# EAGLE design Digital_Level_Mainboard_T01_v2 (EAGLE 7.4.0)
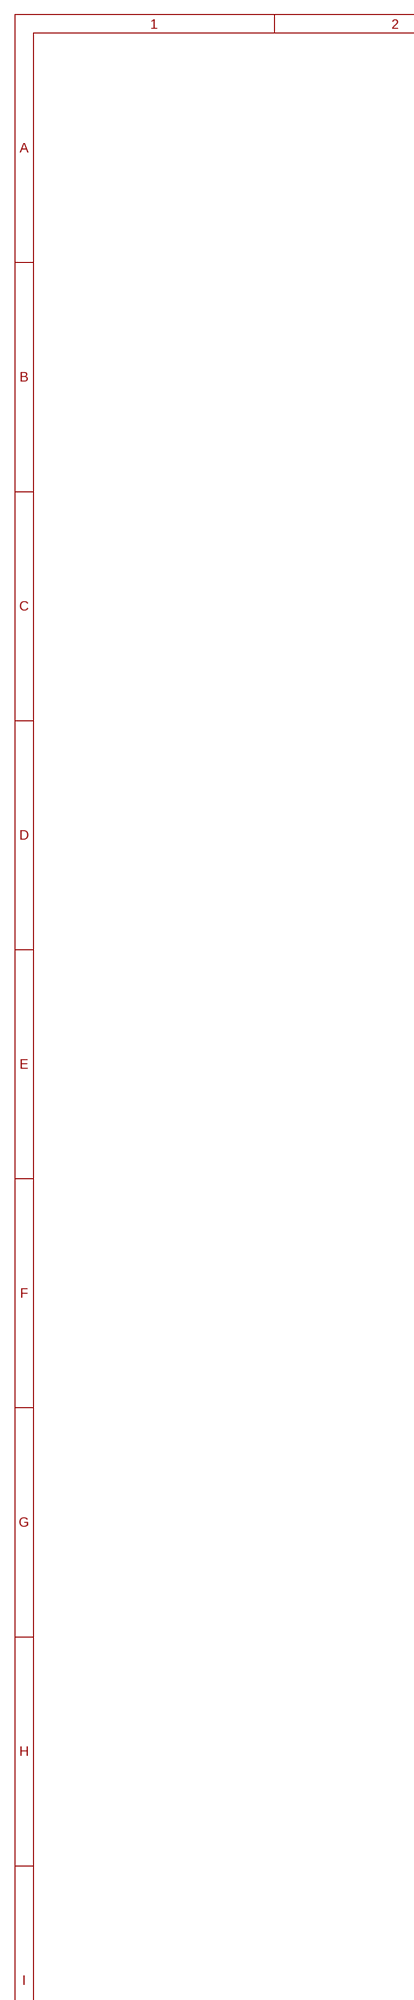
[diagram p0: schematic, sheet 1, part 1 of 2]
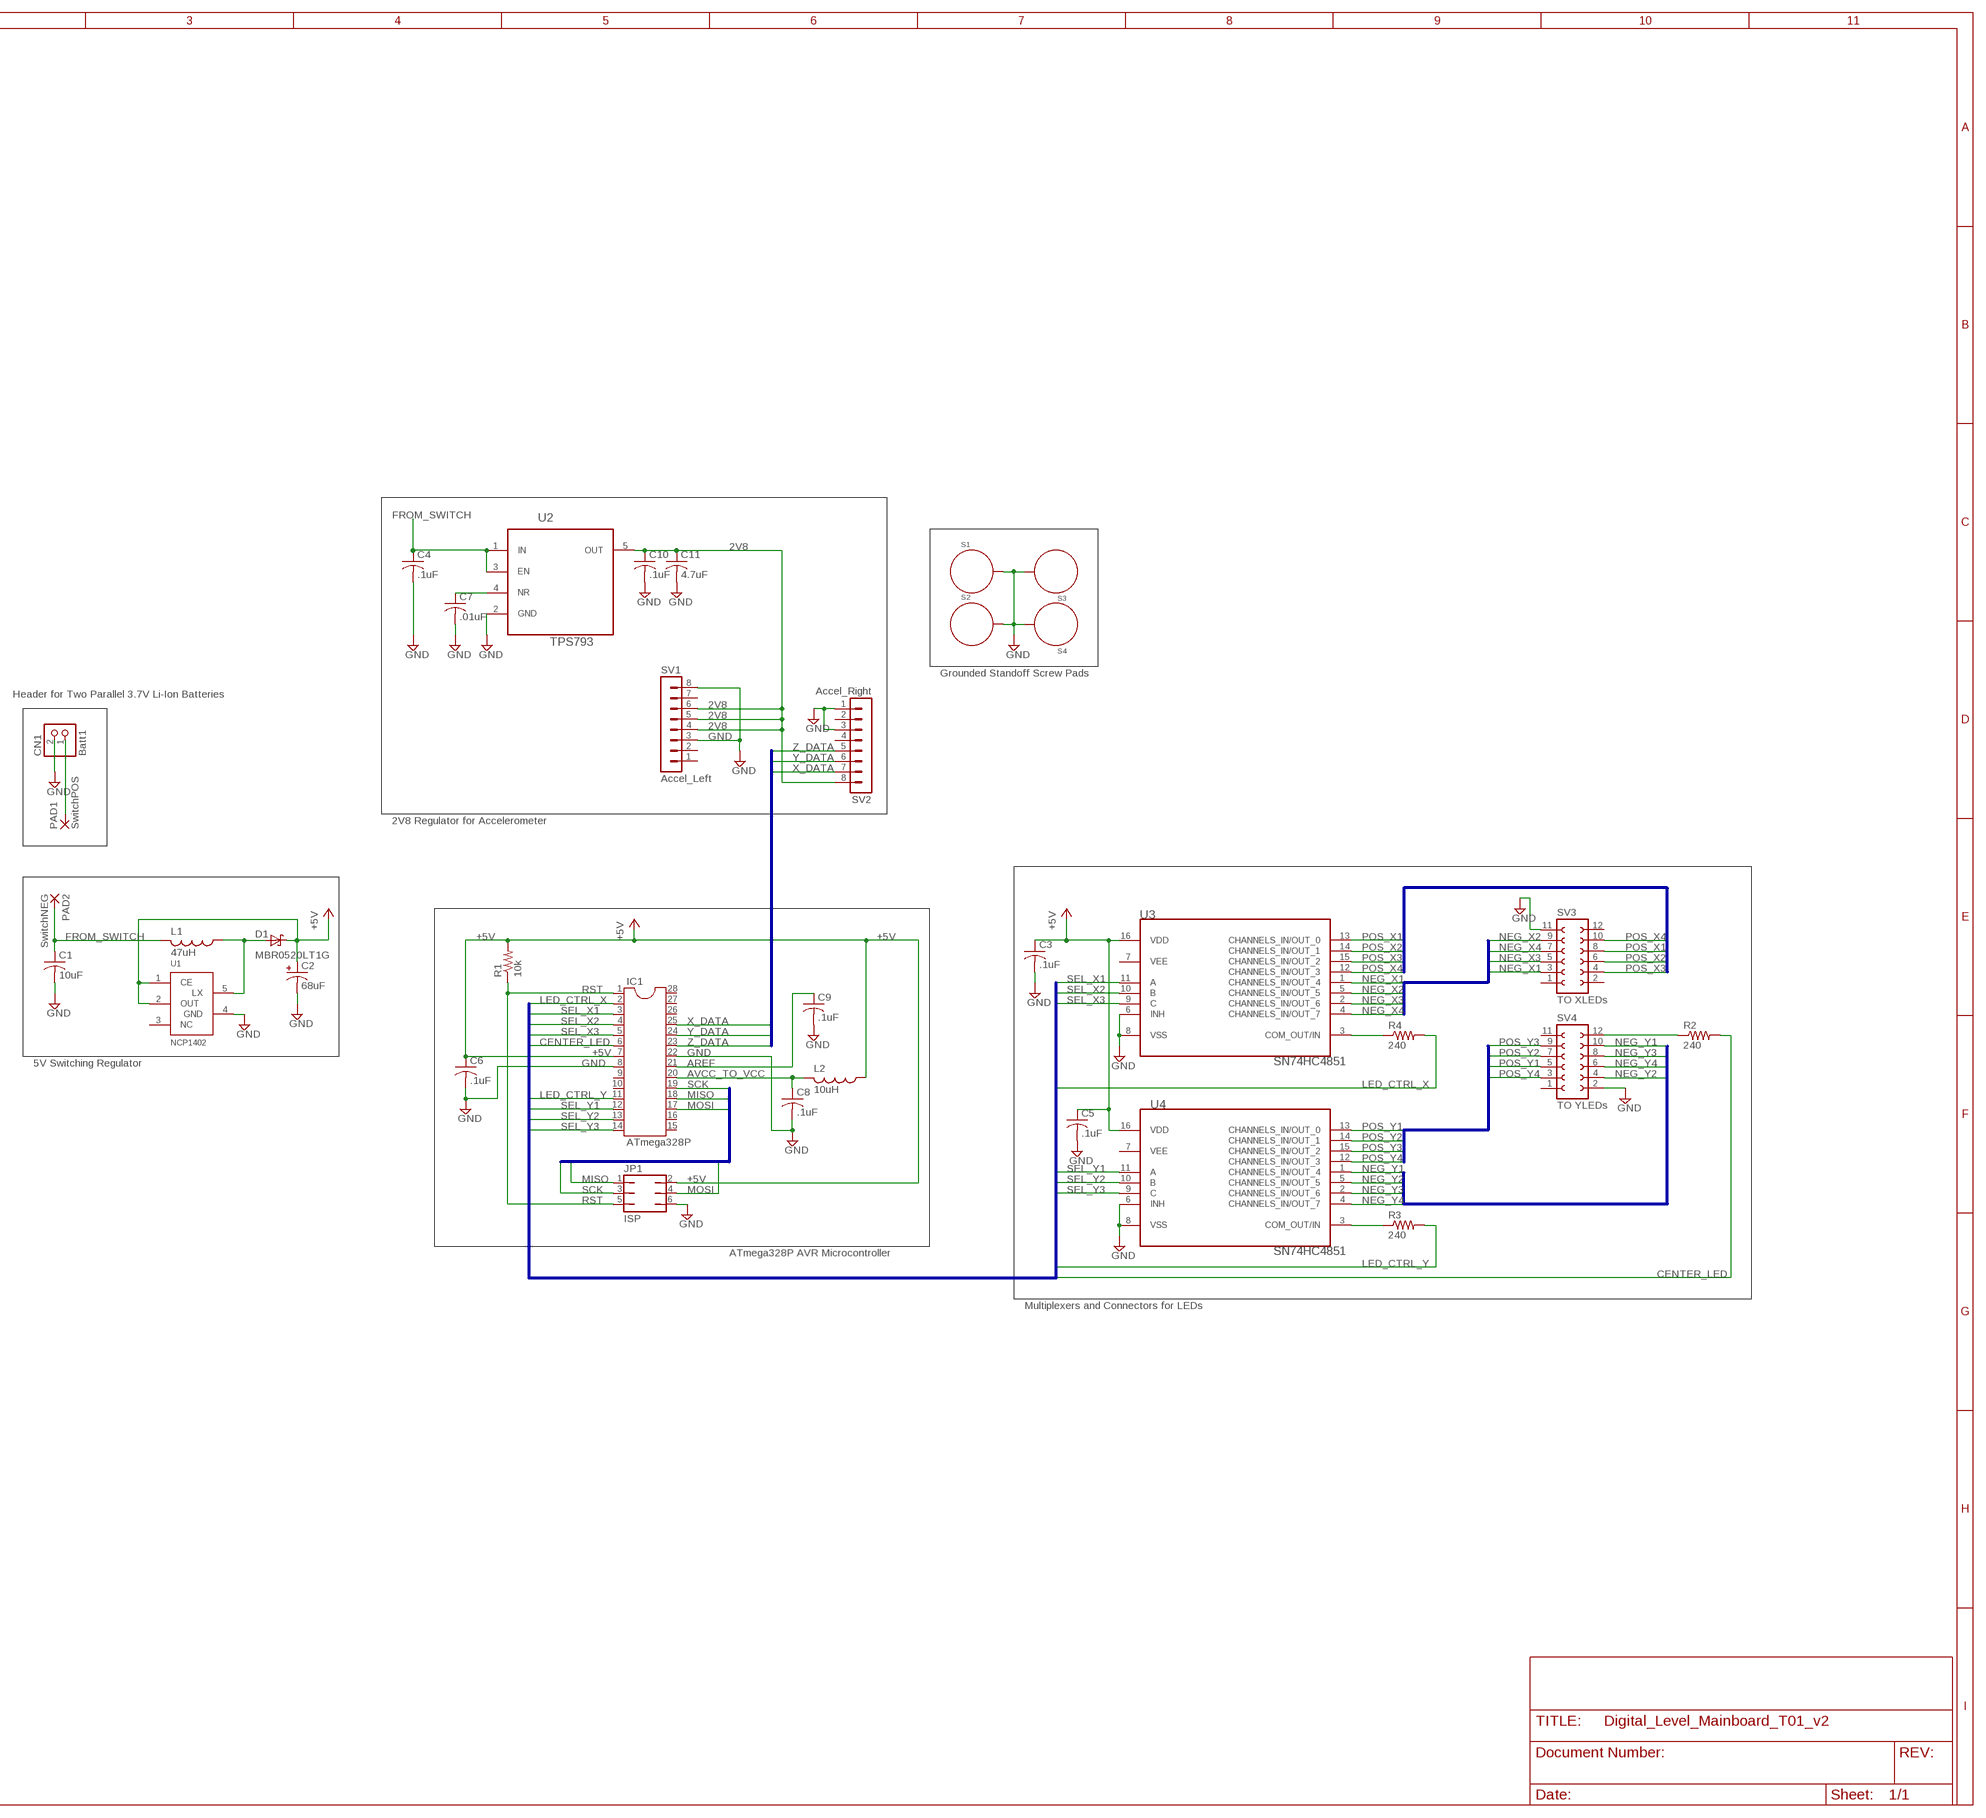
[diagram p1: schematic, sheet 1, part 2 of 2]

## Parts
C1  10uF  C-USC1206K  [C1206K]
C2  68uF  TANT_CAP  [2312_CAP]
C3  .1uF  C-USC1206K  [C1206K]
C4  .1uF  C-USC1206K  [C1206K]
C5  .1uF  C-USC1206K  [C1206K]
C6  .1uF  C-USC1206K  [C1206K]
C7  .01uF  C-USC1206K  [C1206K]
C8  .1uF  C-USC1206K  [C1206K]
C9  .1uF  C-USC1206K  [C1206K]
C10  .1uF  C-USC1206K  [C1206K]
C11  4.7uF  C-USC1206K  [C1206K]
CN1  Batt1  JST_2PIN-SMT  [JST-PH-2-SMT]
D1  MBR0520LT1G  ONSEMI_SCHOTTKY  [MBR0520]
IC1  ATmega328P  DIL28-3  [DIL28-3]
JP1  ISP  JP3Q  [JP3Q]
L1  47uH  BOURNS_INDUCTOR  [BOURNS_INDUCTOR]
L2  10uH  L-USL1812  [L1812]
PAD1  SwitchPOS  2,54/1,1  [2,54/1,1]
PAD2  SwitchNEG  2,54/1,1  [2,54/1,1]
R1  10k  R-US_R0805  [R0805]
R2  240  R-US_R1206  [R1206]
R3  240  R-US_R1206  [R1206]
R4  240  R-US_R1206  [R1206]
S1  STANDOFF_ELECTRICAL  [STANDOFF-ELECTRICAL]
S2  STANDOFF_ELECTRICAL  [STANDOFF-ELECTRICAL]
S3  STANDOFF_ELECTRICAL  [STANDOFF-ELECTRICAL]
S4  STANDOFF_ELECTRICAL  [STANDOFF-ELECTRICAL]
SV1  Accel_Left  MA08-1  [MA08-1]
SV2  Accel_Right  MA08-1  [MA08-1]
SV3  TO XLEDs  FE06-2  [FE06-2]
SV4  TO YLEDs  FE06-2  [FE06-2]
U1  NCP1402  [WSON-8]
U2  TPS793  TPS79328DBVR  [SOT95P280X145-5N]
U3  SN74HC4851  CD4051BE  [DIP254P762X508-16]
U4  SN74HC4851  CD4051BE  [DIP254P762X508-16]

## Nets
2V8: C10.1 C11.1 SV1.4 SV1.5 SV1.6 SV2.8 U2.5(OUT)
5V_REG1_LX: D1.P$2(A) L1.P$1 U1.5(LX)
+5V: C2.P C3.1 C5.1 C6.1 D1.P$1(K) IC1.7 JP1.2 L2.1 R1.2 U1.1(CE) U1.2(OUT) U3.16(VDD) U4.16(VDD)
AREF: C9.1 IC1.21
AVCC_TO_VCC: C8.1 IC1.20 L2.2
CENTER_LED: IC1.6 R2.2
CENTER_LED_CONN: R2.1 SV4.12
CTRL_X_TO_MUX: R4.1 U3.3(COM_OUT/IN)
CTRL_Y_TO_MUX: R3.1 U4.3(COM_OUT/IN)
FROM_SWITCH: C1.1 C4.1 L1.P$2 PAD2.1(P) U2.1(IN) U2.3(EN)
GND: C1.2 C2.N C3.2 C4.2 C5.2 C6.2 C7.2 C8.2 C9.2 C10.2 C11.2 CN1.2 IC1.8 IC1.22 JP1.6 S1.P1 S2.P1 S3.P1 S4.P1 SV1.3 SV1.8 SV2.1 SV2.3 SV3.11 SV4.2 U1.4(GND) U2.2(GND) U3.6(INH) U3.8(VSS) U4.6(INH) U4.8(VSS)
LED_CTRL_X: IC1.2 R4.2
LED_CTRL_Y: IC1.11 R3.2
LIN-REG_NR-PIN: C7.1 U2.4(NR)
MISO: IC1.18 JP1.1
MOSI: IC1.17 JP1.4
NEG_X1: SV3.3 U3.1(CHANNELS_IN/OUT_4)
NEG_X2: SV3.9 U3.5(CHANNELS_IN/OUT_5)
NEG_X3: SV3.5 U3.2(CHANNELS_IN/OUT_6)
NEG_X4: SV3.7 U3.4(CHANNELS_IN/OUT_7)
NEG_Y1: SV4.10 U4.1(CHANNELS_IN/OUT_4)
NEG_Y2: SV4.4 U4.5(CHANNELS_IN/OUT_5)
NEG_Y3: SV4.8 U4.2(CHANNELS_IN/OUT_6)
NEG_Y4: SV4.6 U4.4(CHANNELS_IN/OUT_7)
POS_BATT: CN1.1 PAD1.1(P)
POS_X1: SV3.8 U3.13(CHANNELS_IN/OUT_0)
POS_X2: SV3.6 U3.14(CHANNELS_IN/OUT_1)
POS_X3: SV3.4 U3.15(CHANNELS_IN/OUT_2)
POS_X4: SV3.10 U3.12(CHANNELS_IN/OUT_3)
POS_Y1: SV4.5 U4.13(CHANNELS_IN/OUT_0)
POS_Y2: SV4.7 U4.14(CHANNELS_IN/OUT_1)
POS_Y3: SV4.9 U4.15(CHANNELS_IN/OUT_2)
POS_Y4: SV4.3 U4.12(CHANNELS_IN/OUT_3)
RST: IC1.1 JP1.5 R1.1
SCK: IC1.19 JP1.3
SEL_X1: IC1.3 U3.11(A)
SEL_X2: IC1.4 U3.10(B)
SEL_X3: IC1.5 U3.9(C)
SEL_Y1: IC1.12 U4.11(A)
SEL_Y2: IC1.13 U4.10(B)
SEL_Y3: IC1.14 U4.9(C)
X_DATA: IC1.25 SV2.7
Y_DATA: IC1.24 SV2.6
Z_DATA: IC1.23 SV2.5
Unconnected: IC1.9 IC1.10 IC1.15 IC1.16 IC1.26 IC1.27 IC1.28 SV1.1 SV1.2 SV1.7 SV2.2 SV2.4 SV3.1 SV3.2 SV3.12 SV4.1 SV4.11 U1.3(NC) U3.7(VEE) U4.7(VEE)

## Buses
NEG_Y4,NEG_Y3,NEG_Y2,NEG_Y1
POS_X1,POS_X2,POS_X3,POS_X4
NEG_X4,NEG_X3,NEG_X2,NEG_X1
POS_Y1,POS_Y2,POS_Y3,POS_Y4
X_DATA,Y_DATA,Z_DATA
MISO,MOSI,SCK
LED_CTRL_X,SEL_X1,SEL_X2,SEL_X3,CENTER_LED,LED_CTRL_Y,SEL_Y1,SEL_Y2,SEL_Y3

## Notes on the sheet
- Grounded Standoff Screw Pads
- Header for Two Parallel 3.7V Li-Ion Batteries
- 2V8 Regulator for Accelerometer
- 5V Switching Regulator
- ATmega328P AVR Microcontroller
- Multiplexers and Connectors for LEDs

## Library data of the parts
C1 C3-C11 = rcl:C-US: CAPACITOR, American symbol
C2 = cal_zabel:TANT_CAP
CN1 = adafruit:JST_2PIN: JST 2-Pin Connectors of various flavors SMT-RA (S2B-PH-SM4) 4UConnector #17311 SMT (B2B-PH-SM4) THM-RA (S2B-PH) THM (B2B-PH)
D1 = cal_zabel:ONSEMI_SCHOTTKY
IC1 = ic-package:DIL28: Dual In Line
JP1 = jumper:JP3Q: JUMPER
L1 = cal_zabel:BOURNS_INDUCTOR
L2 = rcl:L-US: INDUCTOR, American symbol
PAD1 PAD2 = wirepad:2,54/1,1: THROUGH-HOLE PAD
R1-R4 = rcl:R-US_: RESISTOR, American symbol
S1-S4 = SparkFun-Electromechanical:STANDOFF_ELECTRICAL: A standoff intended to be an electrically connected point. Pad size and stop size allow for a #4 Phillips pan screw head to make a solid connection to the board.
SV1 SV2 = con-lstb:MA08-1: PIN HEADER; OC_FARNELL: unknown; OC_NEWARK: unknown
SV3 SV4 = con-lsta:FE06-2: FEMALE HEADER; OC_FARNELL: unknown; OC_NEWARK: unknown
U1 = cal_zabel:NCP1402
U2 = Texas Instruments_By_element14_Batch_1:TPS79328DBVR: ULTRALOW-NOISE, HIGH PSRR, FAST RF 200mA LOW-DROPOUT LINEAR REGULATORS IN NanoStar? WAFER CHIP SCALE AND SOT23; MPN: TPS79328DBVR; OC_FARNELL: -; OC_NEWARK: 77C1361; PACKAGE: SOT-23-5; SUPPLIER: Texas Instruments
U3 U4 = Texas Instruments_By_element14_Batch_1:CD4051BE: The CD4051B is a single 8-Channel multiplexer having three binary control inputs.; MPN: CD4051BE; OC_FARNELL: 1106109; OC_NEWARK: 60K5119; PACKAGE: PDIP-16; SUPPLIER: Texas Instruments

## Board
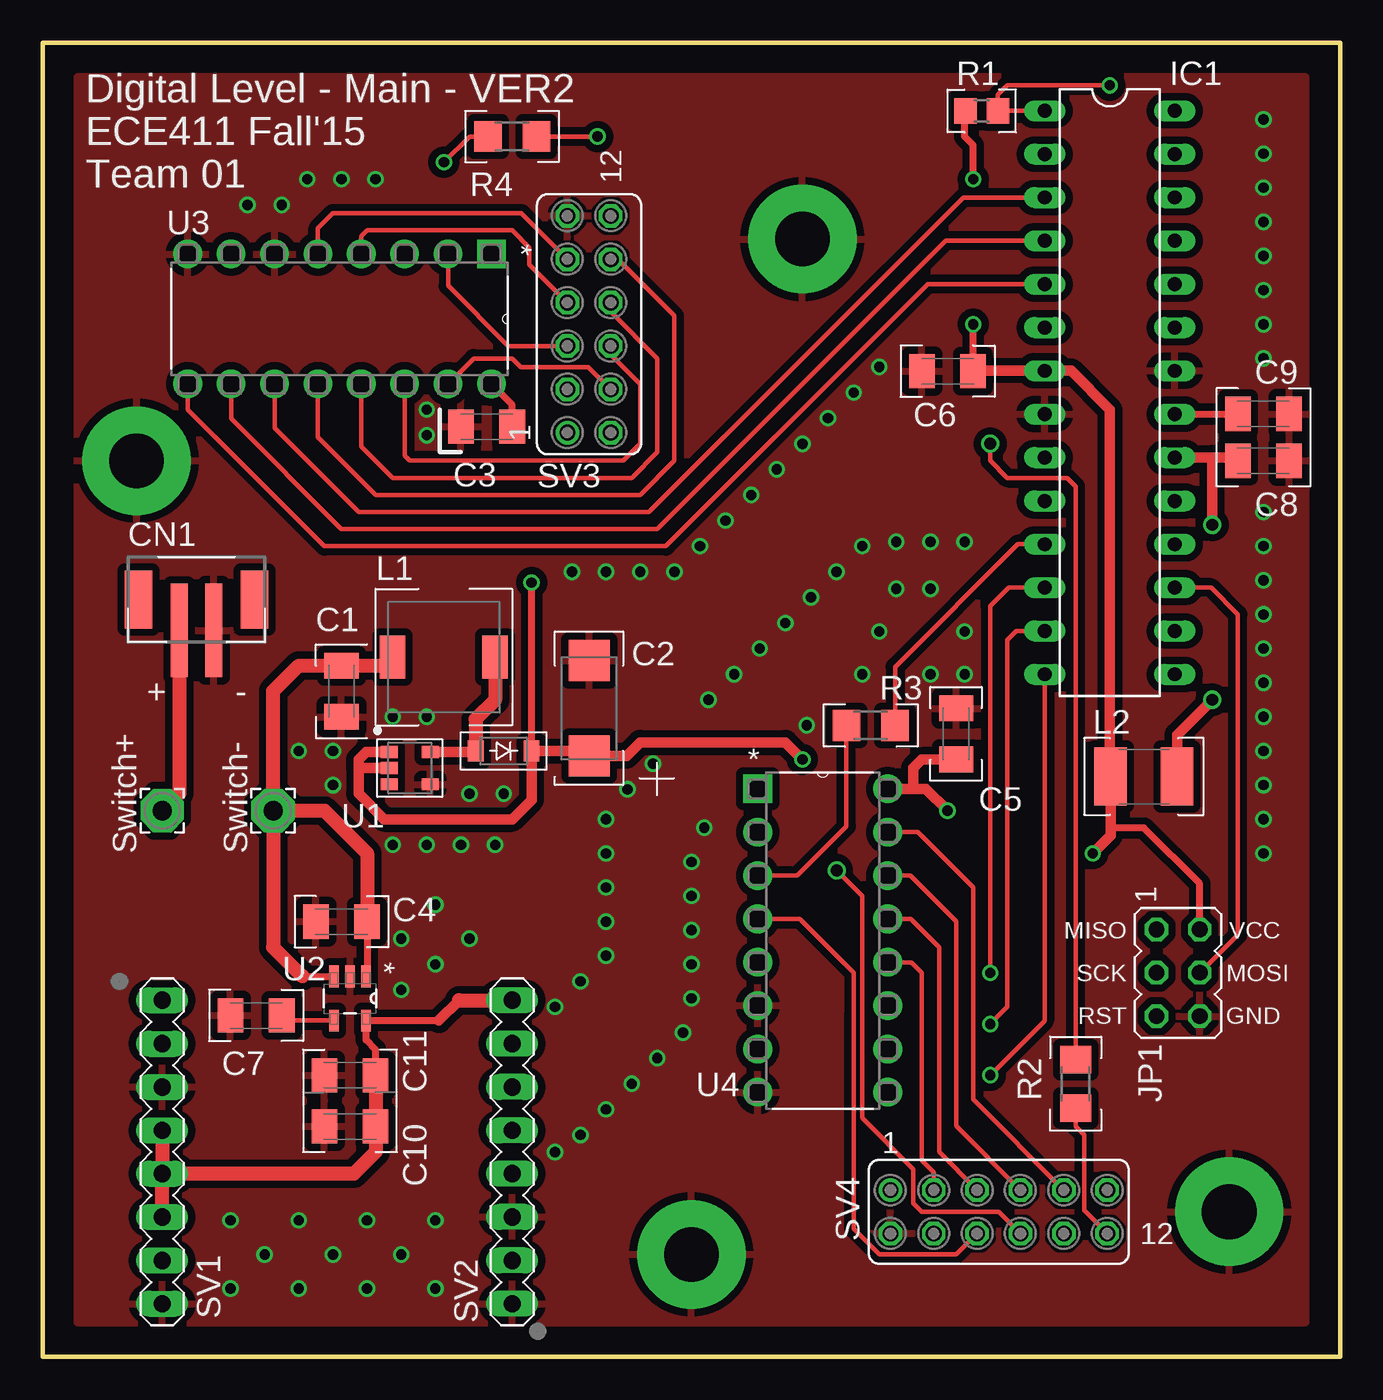
[diagram p2: board, top side]
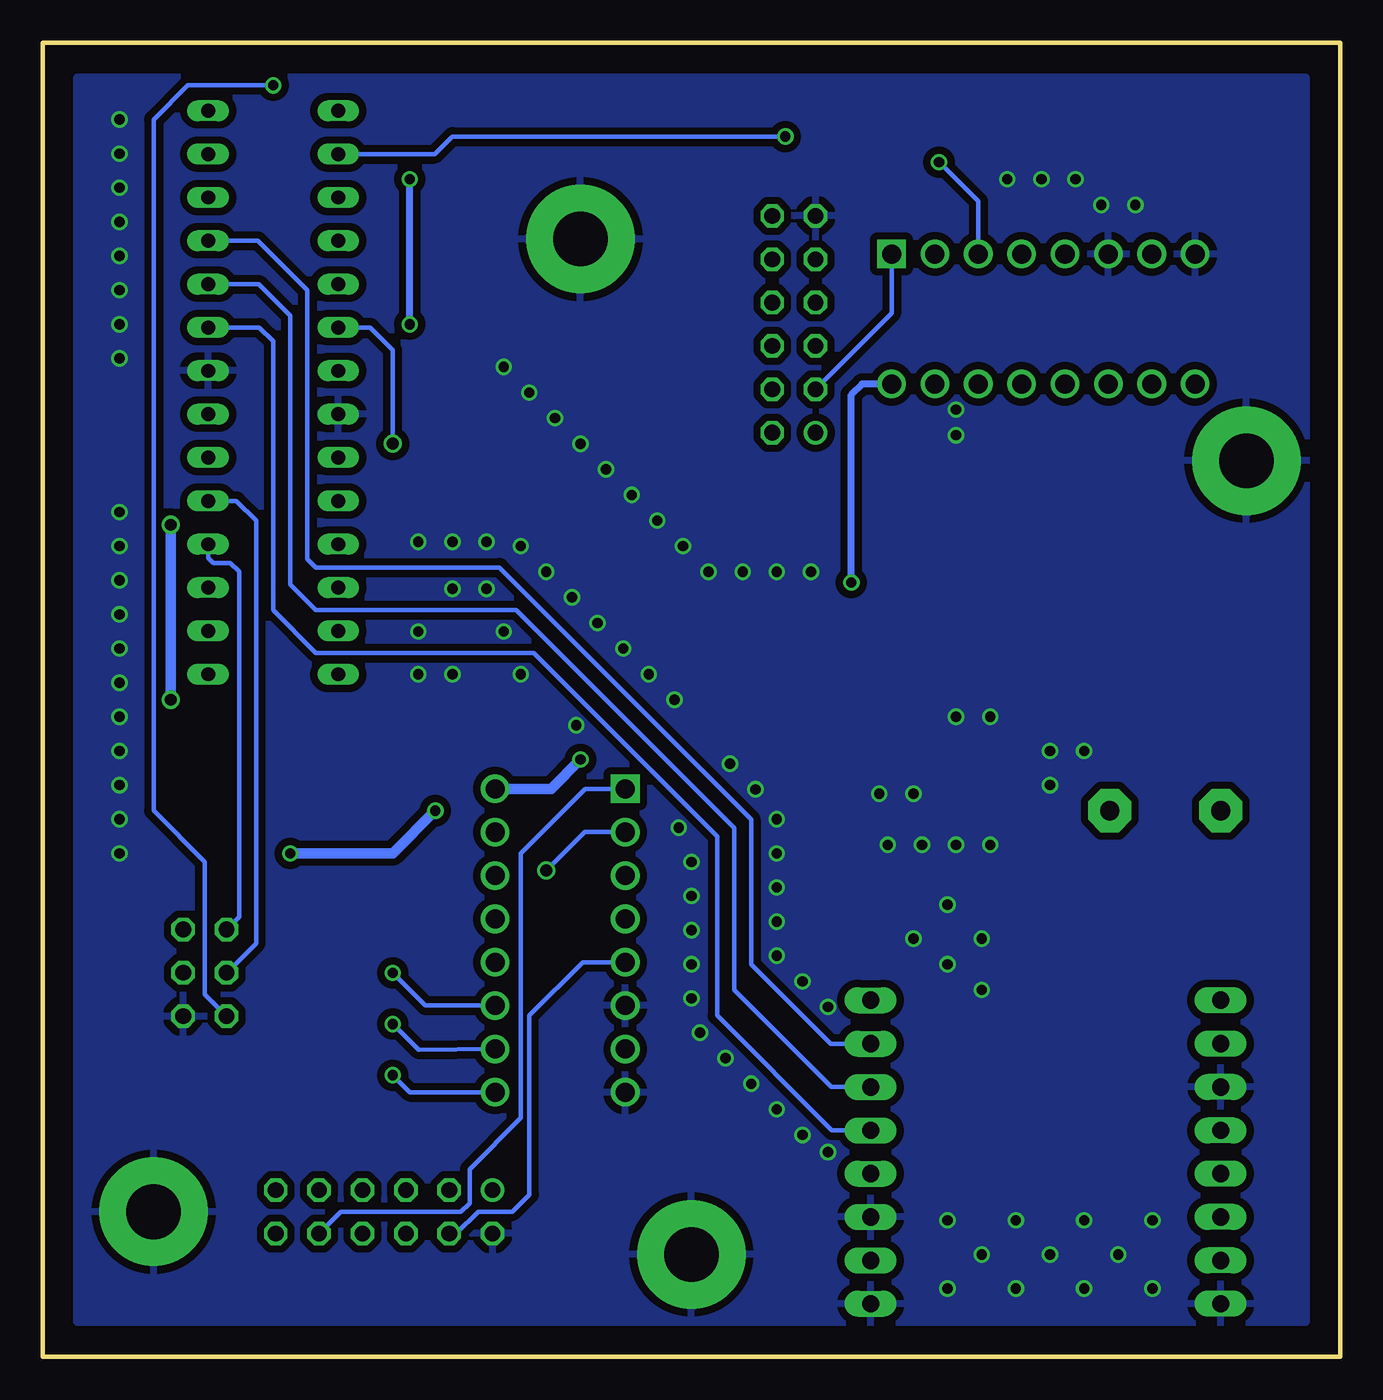
[diagram p3: board, bottom side, seen from below]

Size 76 x 77 mm. Coordinates in mm from the lower left corner, seen from the top.
Outline: 0,0 76,0 76,77 0,77 0,0
Copper layers (1*16): Top 0.0356mm / dielectric 1.5011mm / Bottom 0.0356mm
Design rules "LaenPCBOrder *": minimum track width 6mil, minimum drill 13mil, track to track 8mil, track to pad 8mil, pad to pad 8mil, via to via 8mil, smd to smd 8mil, copper to edge 15mil, drill to drill 6mil, minimum pad ring 7mil, minimum via ring 7mil, stop-mask expansion 3mil, vias tented up to drill 30mil, thermal gap 18mil

### Footprints (pad centres in the part's own frame; a part is rotated, then mirrored left to right if it is on the bottom)
C1206K = smd 1.5 x 2: 1 -1.5,0; 2 1.5,0
2312_CAP = smd 2.4 x 2.4: N -2.8,0; P 2.8,0
JST-PH-2-SMT = smd 1 x 5.5: 1 -1,-1.8; 2 1,-1.8 | smd 1.6 x 3.4: NC1 -3.4,0; NC2 3.4,0
MBR0520 = smd 0.91 x 1.22: P$1 -1.635,0; P$2 1.635,0
DIL28-3 = drill 0.813 long: 1 -16.51,-3.81; 2 -13.97,-3.81; 3 -11.43,-3.81; 4 -8.89,-3.81; 5 -6.35,-3.81; 6 -3.81,-3.81; 7 -1.27,-3.81; 8 1.27,-3.81; 9 3.81,-3.81; 10 6.35,-3.81; 11 8.89,-3.81; 12 11.43,-3.81; 13 13.97,-3.81; 14 16.51,-3.81; 15 16.51,3.81; 16 13.97,3.81; 17 11.43,3.81; 18 8.89,3.81; 19 6.35,3.81; 20 3.81,3.81; 21 1.27,3.81; 22 -1.27,3.81; 23 -3.81,3.81; 24 -6.35,3.81; 25 -8.89,3.81; 26 -11.43,3.81; 27 -13.97,3.81; 28 -16.51,3.81
JP3Q = drill 0.914 octagon: 1 -2.54,-1.27; 2 -2.54,1.27; 3 0,-1.27; 4 0,1.27; 5 2.54,-1.27; 6 2.54,1.27
BOURNS_INDUCTOR = smd 1.5 x 2.5: P$1 -3,0; P$2 3,0
L1812 = smd 1.9 x 3.4: 1 -1.95,0; 2 1.95,0
2,54/1,1 = drill 1.118 pad 2.54 octagon: 1 0,0
R0805 = smd 1.3 x 1.5: 1 -0.95,0; 2 0.95,0
R1206 = smd 1.6 x 1.803: 1 -1.422,0; 2 1.422,0
STANDOFF-ELECTRICAL = drill 3.2 pad 6.35: P1 0,0
MA08-1 = drill 1.016 long: 1 -8.89,0; 2 -6.35,0; 3 -3.81,0; 4 -1.27,0; 5 1.27,0; 6 3.81,0; 7 6.35,0; 8 8.89,0
FE06-2 = drill 0.914: 1 -6.35,1.27 | drill 0.914 octagon: 2 -6.35,-1.27; 3 -3.81,1.27; 4 -3.81,-1.27; 5 -1.27,1.27; 6 -1.27,-1.27; 7 1.27,1.27; 8 1.27,-1.27; 9 3.81,1.27; 10 3.81,-1.27; 11 6.35,1.27; 12 6.35,-1.27
WSON-8 = smd 0.7 x 1: 1 -0.95,-1.2; 2 0,-1.2; 3 0.95,-1.2; 4 0.95,1.2; 5 -0.95,1.2
SOT95P280X145-5N = smd 1.27 x 0.559: 1 -1.295,0.94; 2 -1.295,0; 3 -1.295,-0.94; 4 1.295,-0.94; 5 1.295,0.94
DIP254P762X508-16 = drill 1.118 square: 1 -7.62,17.78 | drill 1.118: 2 -7.62,15.24; 3 -7.62,12.7; 4 -7.62,10.16; 5 -7.62,7.62; 6 -7.62,5.08; 7 -7.62,2.54; 8 -7.62,0; 9 0,0; 10 0,2.54; 11 0,5.08; 12 0,7.62; 13 0,10.16; 14 0,12.7; 15 0,15.24; 16 0,17.78

### Placement (x,y rotation side)
C1  17.5,39 270 top
C2  32,38 270 top
C3  26,54.5 180 top
C4  17.5,25.5 180 top
C5  53.5,36.5 90 top
C6  53,57.75 180 top
C7  12.5,20 180 top
C8  71.5,52.5 0 top
C9  71.5,55.25 0 top
C10  18,13.5 180 top
C11  18,16.5 180 top
CN1  9.01,44.37 0 top
D1  27,35.5 180 top
IC1  62.5,56.5 270 top
JP1  66.5,22.5 270 top
L1  23.5,41 180 top
L2  64.5,34 0 top
PAD1  7,32 0 top
PAD2  13.5,32 0 top
R1  55,73 180 top
R2  60.5,16 90 top
R3  48.5,37 0 top
R4  27.5,71.5 0 top
S1  5.5,52.5 0 top
S2  38,6 0 top
S3  44.5,65.5 0 top
S4  69.5,8.5 0 top
SV1  7,12 270 top
SV2  27.5,12 90 top
SV3  32,60.5 90 top
SV4  56,8.5 0 top
U1  21.5,34.5 270 top
U2  18,21 270 top
U3  8.5,57 270 top
U4  49.5,15.5 0 top

### Tracks (layer width: path | path; a pad name or v marks a point on that pad's centre or on a via)
2V8
  Top 0.406: 23.2,19.7 U2.5 18.94,18.56 19.5,18 C11.1
  Top 0.61: 23.2,19.7 24.39,20.89
  Top 0.813: 24.39,20.89 SV2.8 | C11.1 C10.1 19.5,12 18.23,10.73 SV1.5 | SV1.4 SV1.5 | SV1.6 SV1.5
5V_REG1_LX
  Top 0.61: U1.5 24.82,35.45 D1.P$2
  Top 0.813: L1.P$1 26.5,38.5 25.36,37.37 D1.P$2
+5V  (via drill 0.6)
  Top 0.406: D1.P$1 v28.64,45.37 | C3.1 27.5,55.78 U3.16 | C6.1 v54.5,60.5 | v54.5,69 54.5,71 54,71.5 54,72.95 R1.2 | 62.55,31 64.5,31 67.77,27.73 JP1.2
  Top 0.61: U1.1 18.95,35.45 18.5,35 18.5,34.5 | 18.5,34.5 18.5,33 20,31.5 27.5,31.5 28.64,32.63 D1.P$1 31.7,35.5 C2.P 34.2,35.2 35,36 43.5,36 v44.5,35 | U1.2 18.5,34.5 | U4.16 51,33.28 | 51,33.28 51.72,33.28 v53,32 | v61.5,29.5 62.55,30.55 62.55,31 L2.1 62.5,34.05 62.5,55.5 60.23,57.77 IC1.7 54.52,57.77 C6.1 | C5.1 51.5,35 51,34.5 51,33.28
  Bottom 0.406: U3.16 28,57 28.64,56.37 v28.64,45.37 | v54.5,60.5 v54.5,69
  Bottom 0.61: v44.5,35 46.22,33.28 U4.16 | v53,32 55.5,29.5 v61.5,29.5
AREF
  Top 0.406: IC1.21 69.98,55.23 C9.1
AVCC_TO_VCC  (via drill 0.7)
  Top 0.61: IC1.20 68.5,52.69 | 68.5,52.69 69.81,52.69 C8.1 | L2.2 66.45,36.45 v68.5,38.5 | v68.5,48.75 68.5,52.69
  Bottom 0.61: v68.5,38.5 v68.5,48.75
CENTER_LED  (via drill 0.7)
  Top 0.254: R2.2 60.5,51 60,51.5 56.5,51.5 55.5,52.5 v55.5,53.5
  Bottom 0.254: IC1.6 56.81,60.31 55.5,59 v55.5,53.5
CENTER_LED_CONN
  Top 0.254: SV4.12 61,8.58 61,13 60.5,13.5 R2.1
CTRL_X_TO_MUX  (via drill 0.6)
  Top 0.254: R4.1 25,71.5 v23.5,70
  Bottom 0.254: v23.5,70 21.2,67.7 U3.3
CTRL_Y_TO_MUX
  Top 0.254: R3.1 47.08,31.08 44.2,28.2 U4.3
FROM_SWITCH
  Top 0.254: 19,22.36 U2.1 | 20,40.5 L1.P$2
  Top 0.406: C4.1 19,22.36 | 15.21,22.3 U2.3
  Top 0.813: PAD2.1 13.5,24 14.5,23 15.21,22.3 | PAD2.1 16.5,32 19,29.5 C4.1 | 20,40.5 C1.1 15,40.5 13.5,39 PAD2.1
GND  (via drill 0.6)
  other vias: 15,35.5 17,35.5 17,33.5 20.5,30 22.5,30 25,33 27,33 24.5,30 26.5,30 22.5,37.5 20.5,37.5 49,42.5 35.75,34.75 33,31.5 39,38.5 33,29.5 33,27.5 33,25.5 38.75,31 38,29 44.75,37 40.5,40 48,40 42,41.5 38,27 38,25 38,23 38,21 37.5,19 36,17.5 34.5,16 33,14.5 31.5,13 30,20.5 31.5,22 33,23.5 30,12 52,40 54,40 43.5,43 45,44.5 46.5,46 48,47.5 50,47.75 52,47.75 54,47.75 50,45 52,45 54,42.5 22.5,55.5 22.5,54 34.25,33.25 49,58 33,46 31,46 35,46 37,46 38.5,47.5 40,49 41.5,50.5 43,52 44.5,53.5 46,55 47.5,56.5 11,8 15,8 19,8 23,8 21,6 19,4 23,4 17,6 13,6 15,4 11,4 21,21.5 21,24.5 23,23 25,24.5 23,26.5 71.5,72.5 71.5,70.5 71.5,68.5 71.5,66.5 71.5,64.5 71.5,62.5 71.5,60.5 71.5,58.5 19.5,69 71.5,49.5 71.5,47.5 71.5,45.5 71.5,43.5 71.5,41.5 71.5,39.5 71.5,37.5 71.5,35.5 71.5,33.5 71.5,31.5 71.5,29.5 17.5,69 15.5,69 14,67.5 12,67.5
  pour Bottom (isolate 0.432): 2,2 74,2 74,75 2,75
  pour Top (isolate 0.432): 2,2 74,2 74,75 2,75
LED_CTRL_X  (via drill 0.6)
  Top 0.254: v32.5,71.5 R4.2
  Bottom 0.254: v32.5,71.5 52,71.5 53.03,70.47 IC1.2
LED_CTRL_Y
  Top 0.254: IC1.11 57.11,47.61 49.92,40.42 R3.2
LIN-REG_NR-PIN
  Top 0.254: C7.1 14.79,19.7 U2.4
MISO
  Bottom 0.254: IC1.18 66.31,46.81 66,46.5 65,46.5 64.5,46 64.5,25.77 JP1.1
MOSI
  Top 0.254: IC1.17 68.43,45.07 70,43.5 70,25 70,24.73 JP1.4
NEG_X1
  Bottom 0.254: U3.1 26.28,61.14 SV3.3
NEG_X2
  Top 0.254: SV3.9 28.04,67 17,67 16.12,66.12 U3.5
NEG_X3
  Top 0.254: SV3.5 29.5,59.23 29.13,59.23 27.27,59.23 23.74,62.76 U3.2
NEG_X4
  Top 0.254: SV3.7 28.5,64 28.5,65 27.5,66 19,66 18.66,65.66 U3.4
NEG_Y1
  Bottom 0.254: SV4.10 58.54,8.5 51.5,8.5 51,9 51,11 48,14 48,29.5 44.22,33.28 U4.1
NEG_Y2
  Bottom 0.254: SV4.4 51.77,7.23 50.5,8.5 48.5,8.5 47.5,9.5 47.5,20 44.38,23.12 U4.5
NEG_Y3  (via drill 0.7)
  Top 0.254: SV4.8 56,8.5 51.5,8.5 51,9 51,11 48,14 48,27 v46.5,28.5
  Bottom 0.254: U4.2 44.26,30.74 v46.5,28.5
NEG_Y4
  Top 0.254: SV4.6 53.5,6 49,6 47.5,7.5 47.5,20 47.5,20.04 47.5,22.5 44.34,25.66 U4.4
POS_BATT
  Top 0.813: CN1.1 8.01,33.01 PAD1.1
POS_X1
  Top 0.254: SV3.8 33.27,61.23 36,58.5 36,53 34.5,51.5 20.5,51.5 18.66,53.34 U3.13
POS_X2
  Top 0.254: SV3.6 33.27,58.73 35,57 35,53.5 34,52.5 21.5,52.5 21.2,52.8 U3.14
POS_X3
  Top 0.254: U3.15 25.24,58.5 27.5,58.5 28,58 31.96,58 SV3.4
POS_X4
  Top 0.254: SV3.10 33.69,64.31 37,61 37,52.5 35,50.5 19.5,50.5 16.12,53.88 U3.12
POS_Y1
  Top 0.254: U4.13 50.84,25.66 52.5,24 52.5,12 SV4.5
POS_Y2
  Top 0.254: 57.23,9.77 SV4.7 53.5,13.54 53.5,25.5 50.8,28.2 U4.14
POS_Y3
  Top 0.254: U4.15 51.26,30.74 54.5,27.5 54.5,15.08 SV4.9
POS_Y4
  Top 0.254: SV4.3 52.19,10.81 51.5,11.5 51.5,22.5 50.88,23.12 U4.12
RST  (via drill 0.6)
  Top 0.254: IC1.1 57.96,73.01 57.96,73 R1.1 55.95,73.95 56.5,74.5 v62.5,74.5
  Bottom 0.254: v62.5,74.5 67.5,74.5 69.5,72.5 69.5,32 66.5,29 66.5,21.23 JP1.5
SCK
  Bottom 0.254: IC1.19 64.65,50.15 63.5,49 63.5,24.23 JP1.3
SEL_X1
  Top 0.254: IC1.3 53.93,67.93 35.5,49.5 18.5,49.5 13.58,54.42 U3.11
SEL_X2
  Top 0.254: IC1.4 52.89,65.39 36,48.5 17.5,48.5 11.04,54.96 U3.10
SEL_X3
  Top 0.254: IC1.5 51.85,62.85 36.5,47.5 16.5,47.5 8.5,55.5 U3.9
SEL_Y1  (via drill 0.6)
  Top 0.254: IC1.12 56.57,45.07 55.5,44 v55.5,22.5
  Bottom 0.254: v55.5,22.5 53.58,20.58 U4.11
SEL_Y2  (via drill 0.6)
  Top 0.254: v55.5,19.5 56.5,20.5 56.5,42 57.03,42.53 IC1.13
  Bottom 0.254: U4.10 53.96,18 54.5,18.5 v55.5,19.5
SEL_Y3  (via drill 0.6)
  Top 0.254: IC1.14 58.69,19.69 v55.5,16.5
  Bottom 0.254: U4.9 54.5,15.5 v55.5,16.5
X_DATA
  Bottom 0.254: IC1.25 63.39,65.39 60.5,62.5 60.5,46.75 60,46.25 49.25,46.25 34.5,31.5 34.5,23 29.85,18.35 SV2.7
Y_DATA
  Bottom 0.254: IC1.24 63.35,62.85 61.5,61 61.5,45.25 60,43.75 48.25,43.75 35.5,31 35.5,21.5 29.81,15.81 SV2.6
Z_DATA
  Bottom 0.254: IC1.23 63.31,60.31 62.5,59.5 62.5,43.75 60,41.25 47.25,41.25 36.5,30.5 36.5,20 29.77,13.27 SV2.5

### Text on the board
tPlace: Digital Level - Main - VER2 | ECE411 Fall'15 | Team 01 | L1 | Switch+ | Switch- | MISO | VCC | SCK | MOSI | RST | GND
tDocu: D1 | FXLN8371Q